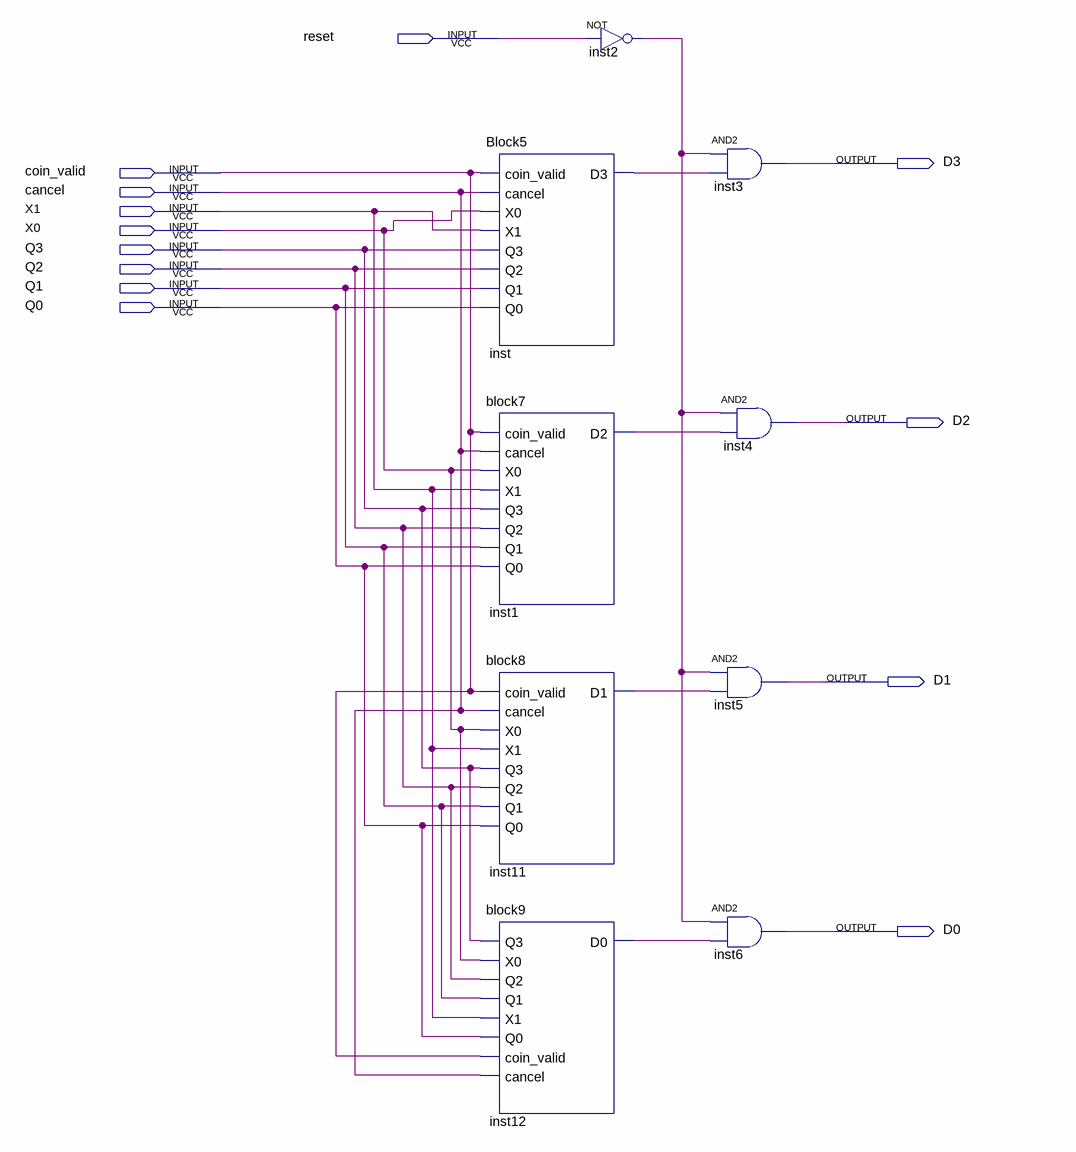
[diagram p0: schematic sheet]
// Quartus schematic block10.bdf as structural Verilog: 9 symbols, 13 pins
module block10 (
  input  reset,
  input  coin_valid,
  input  cancel,
  input  X1,
  input  X0,
  input  Q3,
  input  Q2,
  input  Q1,
  input  Q0,
  output D3,
  output D2,
  output D1,
  output D0
);

  wire inst1_d2, inst2_out, inst11_d1, inst12_d0, inst_d3;

  Block5 inst (
    .coin_valid(coin_valid), .cancel(cancel), .X0(X0), .X1(X1), .Q3(Q3), .Q2(Q2), .Q1(Q1), .Q0(Q0),
    .D3(inst_d3));
  block7 inst1 (
    .coin_valid(coin_valid), .cancel(cancel), .X0(X0), .X1(X1), .Q3(Q3), .Q2(Q2), .Q1(Q1), .Q0(Q0),
    .D2(inst1_d2));
  block8 inst11 (
    .coin_valid(coin_valid), .cancel(cancel), .X0(X0), .X1(X1), .Q3(Q3), .Q2(Q2), .Q1(Q1), .Q0(Q0),
    .D1(inst11_d1));
  block9 inst12 (
    .Q3(Q3), .X0(X0), .Q2(Q2), .Q1(Q1), .X1(X1), .Q0(Q0), .coin_valid(coin_valid), .cancel(cancel),
    .D0(inst12_d0));
  not inst2 (inst2_out, reset);
  and inst3 (D3, inst2_out, inst_d3);
  and inst5 (D1, inst2_out, inst11_d1);
  and inst6 (D0, inst2_out, inst12_d0);
  and inst4 (D2, inst2_out, inst1_d2);
endmodule
